# EAGLE design EpromEmu (EAGLE 6.6.0)
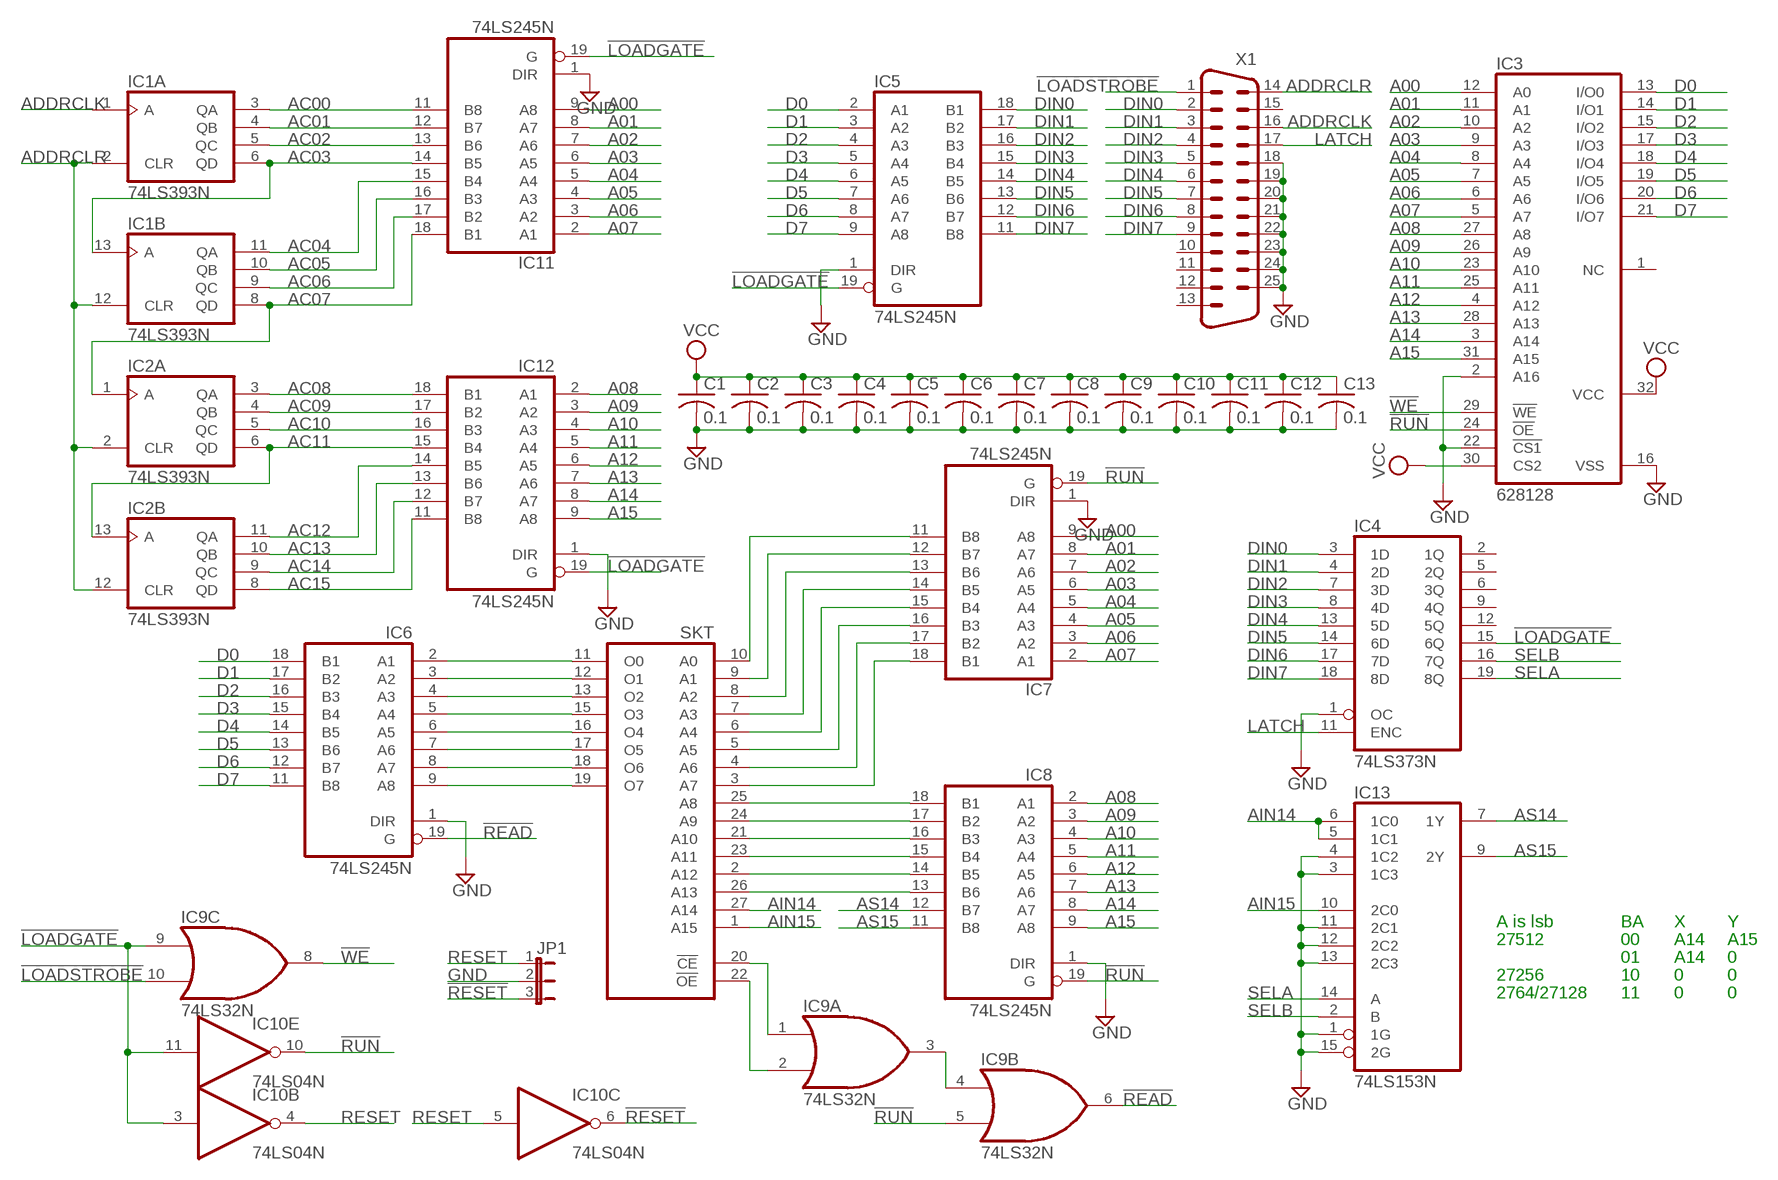
[diagram p0: schematic, sheet 1]

## Parts
C1  0.1  C-US050-025X075  [C050-025X075]
C2  0.1  C-US050-025X075  [C050-025X075]
C3  0.1  C-US050-025X075  [C050-025X075]
C4  0.1  C-US050-025X075  [C050-025X075]
C5  0.1  C-US050-025X075  [C050-025X075]
C6  0.1  C-US050-025X075  [C050-025X075]
C7  0.1  C-US050-025X075  [C050-025X075]
C8  0.1  C-US050-025X075  [C050-025X075]
C9  0.1  C-US050-025X075  [C050-025X075]
C10  0.1  C-US050-025X075  [C050-025X075]
C11  0.1  C-US050-025X075  [C050-025X075]
C12  0.1  C-US050-025X075  [C050-025X075]
C13  0.1  C-US050-025X075  [C050-025X075]
IC1  74LS393N  [DIL14]
IC2  74LS393N  [DIL14]
IC3  628128  628128P  [DIL32]
IC4  74LS373N  [DIL20]
IC5  74LS245N  [DIL20]
IC6  74LS245N  [DIL20]
IC7  74LS245N  [DIL20]
IC8  74LS245N  [DIL20]
IC9  74LS32N  [DIL14]
IC10  74LS04N  [DIL14]
IC11  74LS245N  [DIL20]
IC12  74LS245N  [DIL20]
IC13  74LS153N  [DIL16]
JP1  JP2E  [JP2]
SKT  27512  [DIL28]
X1  M25HP  [M25HP]

## Nets
!LOADGATE: IC4.15(6Q) IC5.19(G) IC9.9(C:I0) IC10.3(B:I) IC10.11(E:I) IC11.19(G) IC12.19(G)
!LOADSTROBE: IC9.10(C:I1) X1.1
!READ: IC6.19(G) IC9.6(B:O)
!RESET: IC10.6(C:O) JP1.3
!RUN: IC3.24(!OE) IC7.19(G) IC8.19(G) IC9.5(B:I1) IC10.10(E:O)
!WE: IC3.29(!WE) IC9.8(C:O)
A00: IC3.12(A0) IC7.9(A8) IC11.9(A8)
A01: IC3.11(A1) IC7.8(A7) IC11.8(A7)
A02: IC3.10(A2) IC7.7(A6) IC11.7(A6)
A03: IC3.9(A3) IC7.6(A5) IC11.6(A5)
A04: IC3.8(A4) IC7.5(A4) IC11.5(A4)
A05: IC3.7(A5) IC7.4(A3) IC11.4(A3)
A06: IC3.6(A6) IC7.3(A2) IC11.3(A2)
A07: IC3.5(A7) IC7.2(A1) IC11.2(A1)
A08: IC3.27(A8) IC8.2(A1) IC12.2(A1)
A09: IC3.26(A9) IC8.3(A2) IC12.3(A2)
A10: IC3.23(A10) IC8.4(A3) IC12.4(A3)
A11: IC3.25(A11) IC8.5(A4) IC12.5(A4)
A12: IC3.4(A12) IC8.6(A5) IC12.6(A5)
A13: IC3.28(A13) IC8.7(A6) IC12.7(A6)
A14: IC3.3(A14) IC8.8(A7) IC12.8(A7)
A15: IC3.31(A15) IC8.9(A8) IC12.9(A8)
AC00: IC1.3(A:QA) IC11.11(B8)
AC01: IC1.4(A:QB) IC11.12(B7)
AC02: IC1.5(A:QC) IC11.13(B6)
AC03: IC1.6(A:QD) IC1.13(B:A) IC11.14(B5)
AC04: IC1.11(B:QA) IC11.15(B4)
AC05: IC1.10(B:QB) IC11.16(B3)
AC06: IC1.9(B:QC) IC11.17(B2)
AC07: IC1.8(B:QD) IC2.1(A:A) IC11.18(B1)
AC08: IC2.3(A:QA) IC12.18(B1)
AC09: IC2.4(A:QB) IC12.17(B2)
AC10: IC2.5(A:QC) IC12.16(B3)
AC11: IC2.6(A:QD) IC2.13(B:A) IC12.15(B4)
AC12: IC2.11(B:QA) IC12.14(B5)
AC13: IC2.10(B:QB) IC12.13(B6)
AC14: IC2.9(B:QC) IC12.12(B7)
AC15: IC2.8(B:QD) IC12.11(B8)
ADDRCLK: IC1.1(A:A) X1.16
ADDRCLR: IC1.2(A:CLR) IC1.12(B:CLR) IC2.2(A:CLR) IC2.12(B:CLR) X1.14
AIN14: IC13.5(1C1) IC13.6(1C0) SKT.27(A14)
AIN15: IC13.10(2C0) SKT.1(A15)
AS14: IC8.12(B7) IC13.7(1Y)
AS15: IC8.11(B8) IC13.9(2Y)
D0: IC3.13(I/O0) IC5.2(A1) IC6.18(B1)
D1: IC3.14(I/O1) IC5.3(A2) IC6.17(B2)
D2: IC3.15(I/O2) IC5.4(A3) IC6.16(B3)
D3: IC3.17(I/O3) IC5.5(A4) IC6.15(B4)
D4: IC3.18(I/O4) IC5.6(A5) IC6.14(B5)
D5: IC3.19(I/O5) IC5.7(A6) IC6.13(B6)
D6: IC3.20(I/O6) IC5.8(A7) IC6.12(B7)
D7: IC3.21(I/O7) IC5.9(A8) IC6.11(B8)
DIN0: IC4.3(1D) IC5.18(B1) X1.2
DIN1: IC4.4(2D) IC5.17(B2) X1.3
DIN2: IC4.7(3D) IC5.16(B3) X1.4
DIN3: IC4.8(4D) IC5.15(B4) X1.5
DIN4: IC4.13(5D) IC5.14(B5) X1.6
DIN5: IC4.14(6D) IC5.13(B6) X1.7
DIN6: IC4.17(7D) IC5.12(B7) X1.8
DIN7: IC4.18(8D) IC5.11(B8) X1.9
GND: C1.2 C2.2 C3.2 C4.2 C5.2 C6.2 C7.2 C8.2 C9.2 C10.2 C11.2 C12.2 C13.2 IC3.2(A16) IC3.16(VSS) IC3.22(!CS1) IC4.1(OC) IC5.1(DIR) IC6.1(DIR) IC7.1(DIR) IC8.1(DIR) IC11.1(DIR) IC12.1(DIR) IC13.1(1G) IC13.3(1C3) IC13.4(1C2) IC13.11(2C1) IC13.12(2C2) IC13.13(2C3) IC13.15(2G) JP1.2 X1.18 X1.19 X1.20 X1.21 X1.22 X1.23 X1.24 X1.25
LATCH: IC4.11(ENC) X1.17
N$1: IC6.2(A1) SKT.11(O0)
N$2: IC6.3(A2) SKT.12(O1)
N$3: IC6.4(A3) SKT.13(O2)
N$4: IC6.5(A4) SKT.15(O3)
N$5: IC6.6(A5) SKT.16(O4)
N$6: IC6.7(A6) SKT.17(O5)
N$7: IC6.8(A7) SKT.18(O6)
N$8: IC6.9(A8) SKT.19(O7)
N$9: IC9.2(A:I1) SKT.22(!OE)
N$10: IC9.1(A:I0) SKT.20(!CE)
N$11: IC8.13(B6) SKT.26(A13)
N$12: IC8.14(B5) SKT.2(A12)
N$13: IC8.15(B4) SKT.23(A11)
N$14: IC8.16(B3) SKT.21(A10)
N$15: IC8.17(B2) SKT.24(A9)
N$16: IC8.18(B1) SKT.25(A8)
N$17: IC7.18(B1) SKT.3(A7)
N$18: IC7.17(B2) SKT.4(A6)
N$19: IC7.16(B3) SKT.5(A5)
N$20: IC7.15(B4) SKT.6(A4)
N$21: IC7.14(B5) SKT.7(A3)
N$22: IC7.13(B6) SKT.8(A2)
N$23: IC7.12(B7) SKT.9(A1)
N$24: IC7.11(B8) SKT.10(A0)
N$25: IC9.3(A:O) IC9.4(B:I0)
RESET: IC10.4(B:O) IC10.5(C:I) JP1.1
SELA: IC4.19(8Q) IC13.14(A)
SELB: IC4.16(7Q) IC13.2(B)
VCC [power]: C1.1 C2.1 C3.1 C4.1 C5.1 C6.1 C7.1 C8.1 C9.1 C10.1 C11.1 C12.1 C13.1 IC3.30(CS2) IC3.32(VCC)
Unconnected: IC3.1(NC) IC4.2(1Q) IC4.5(2Q) IC4.6(3Q) IC4.9(4Q) IC4.12(5Q) IC9.11(D:O) IC9.12(D:I0) IC9.13(D:I1) IC10.1(A:I) IC10.2(A:O) IC10.8(D:O) IC10.9(D:I) IC10.12(F:O) IC10.13(F:I) X1.10 X1.11 X1.12 X1.13 X1.15 X1.G1 X1.G2

## Notes on the sheet
- A is lsb | BA | X | Y
- 27512 | 00 | A14 | A15
- 01 | A14 | 0
- 27256 | 10 | 0 | 0
- 2764/27128 | 11 | 0 | 0

## Power pins joined to a net without a drawn wire
GND: IC1.7(P:GND) IC2.7(P:GND) IC4.10(GND) IC5.10(GND) IC6.10(GND) IC7.10(GND) IC8.10(GND) IC9.7(P:GND) IC10.7(P:GND) IC11.10(GND) IC12.10(GND) IC13.8(GND) SKT.14(GND)
VCC: IC1.14(P:VCC) IC2.14(P:VCC) IC4.20(VCC) IC5.20(VCC) IC6.20(VCC) IC7.20(VCC) IC8.20(VCC) IC9.14(P:VCC) IC10.14(P:VCC) IC11.20(VCC) IC12.20(VCC) IC13.16(VCC) SKT.28(VCC)

## Library data of the parts
C1-C13 = rcl:C-US: CAPACITOR, American symbol
IC1 IC2 = 74xx-us:74*393: Dual 4-bit decade and binary COUNTER
IC3 = memory-hitachi:628128P: MEMORY; OC_FARNELL: unknown; OC_NEWARK: unknown
IC4 = 74xx-us:74*373: Octal D type transparent LATCH, edge triggered
IC5-IC8 IC11 IC12 = 74xx-us:74*245: Octal BUS TRANSCEIVER, 3-state
IC9 = 74xx-us:74*32: Quad 2-input OR gate
IC10 = 74xx-us:74*04: Hex INVERTER
IC13 = 74xx-us:74*153: Dual 4-line to 1-line data SELECTOR/MULTIPLEXER
JP1 = jumper:JP2E: JUMPER
SKT = memory:27512: MEMORY
X1 = con-subd:M25HP: SUB-D; OC_FARNELL: unknown; OC_NEWARK: unknown

## Net classes
1 power: width 0.508 mm, clearance 0.127 mm

## Board
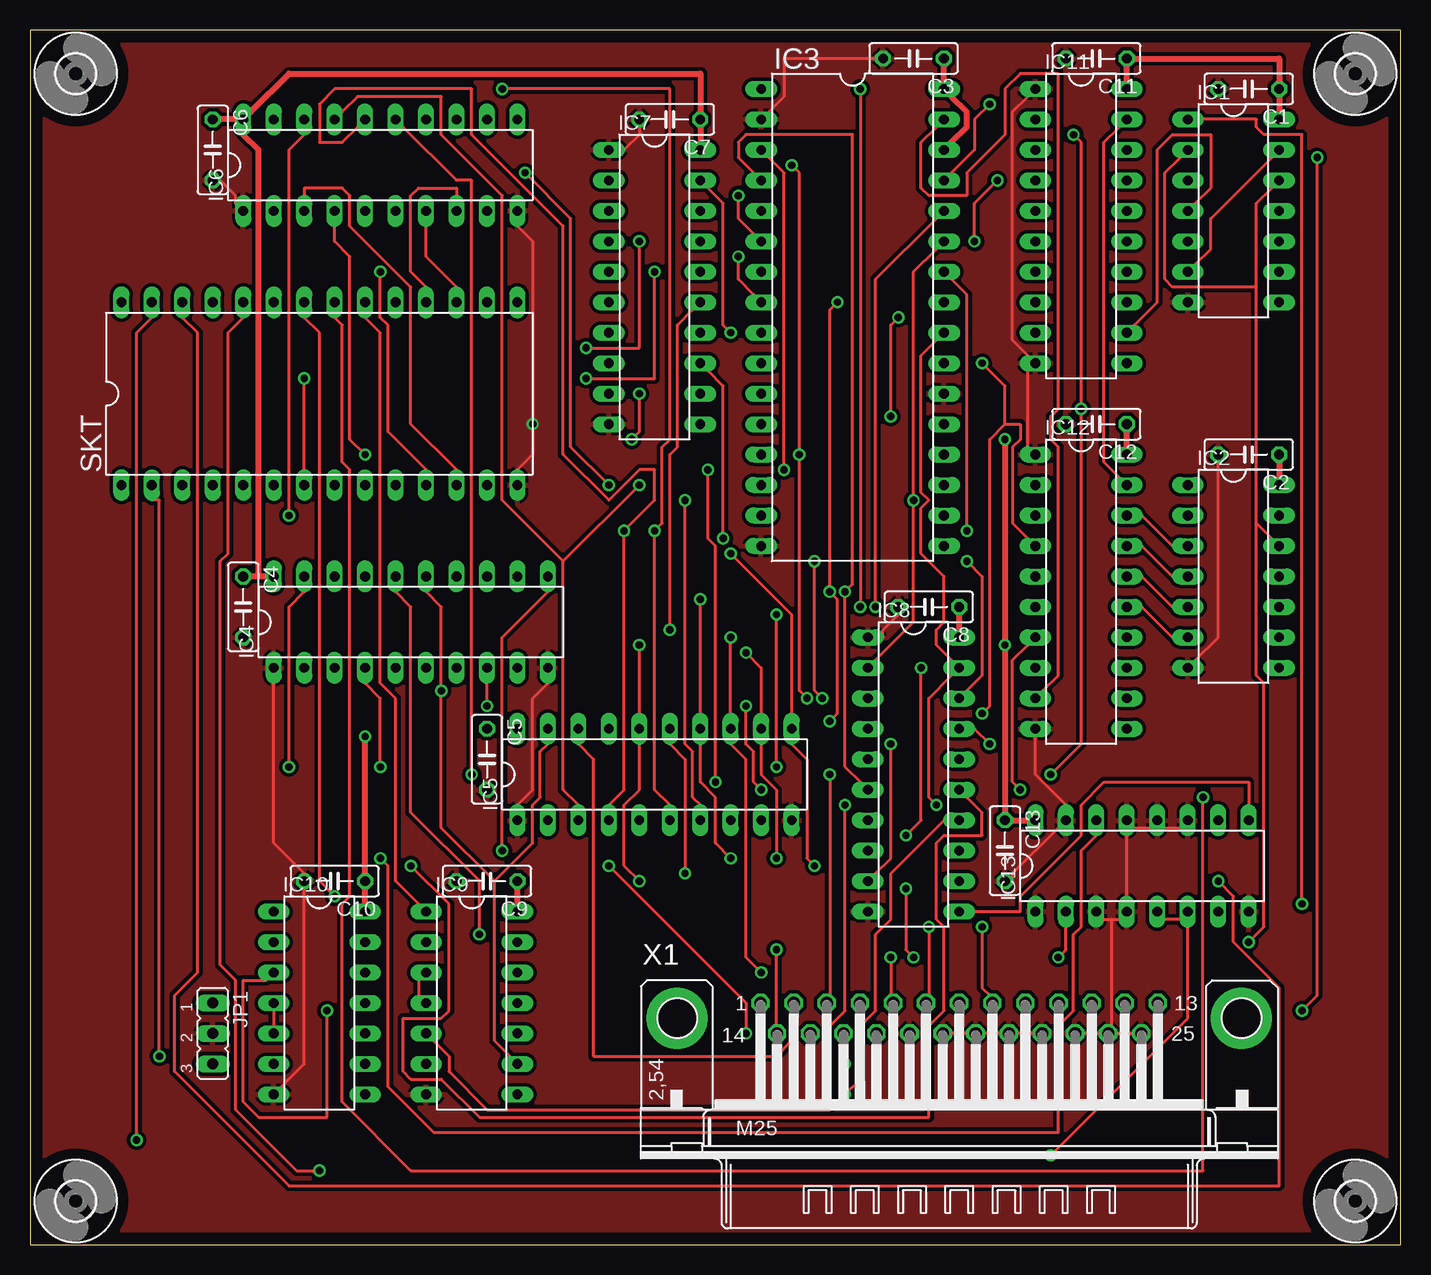
[diagram p1: board, top side]
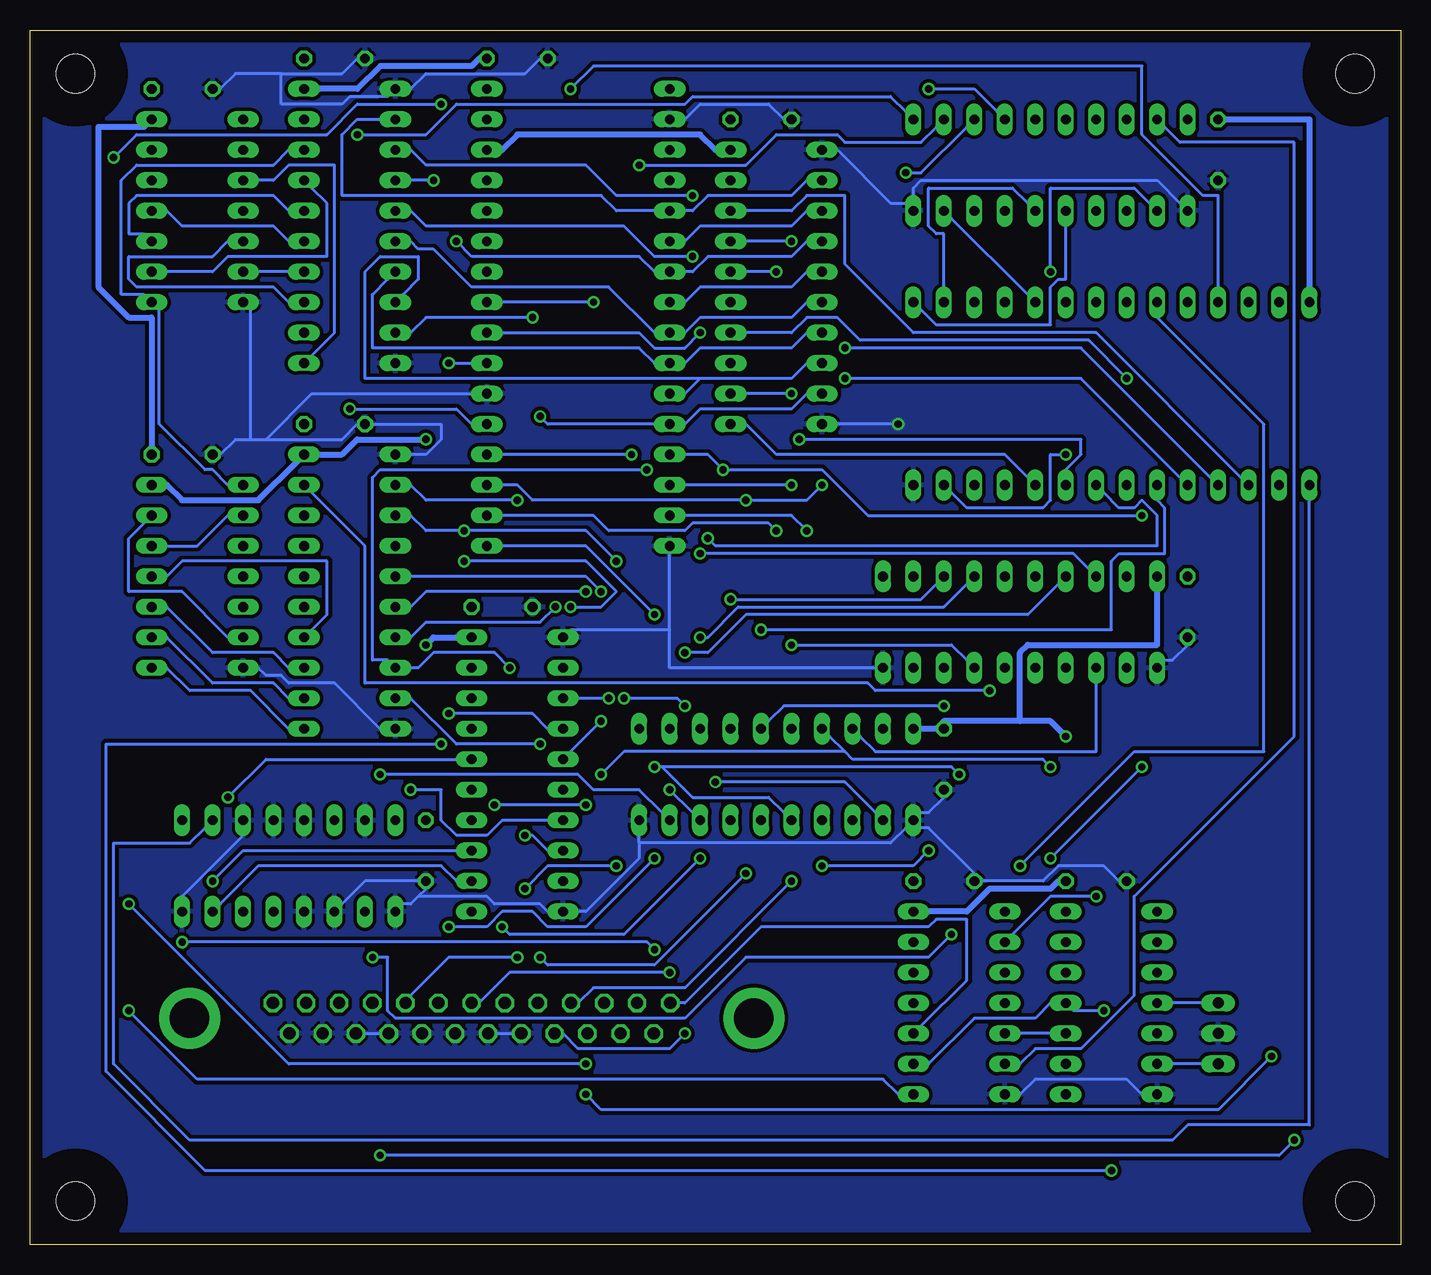
[diagram p2: board, bottom side, seen from below]

Size 114.28 x 101.27 mm. Coordinates in mm from the lower left corner, seen from the top.
Outline: 0,0 114.28,0 114.28,101.27 0,101.27 0,0
Copper layers (1*16): Top 0.035mm / dielectric 1.5mm / Bottom 0.035mm
Design rules "default": minimum track width 10mil, minimum drill 24mil, track to track 8mil, track to pad 8mil, pad to pad 8mil, via to via 8mil, smd to smd 8mil, copper to edge 40mil, drill to drill 8mil, minimum pad ring 10mil, minimum via ring 8mil, stop-mask expansion 4mil, vias tented up to drill 0mil, thermal gap 10mil

### Footprints (pad centres in the part's own frame; a part is rotated, then mirrored left to right if it is on the bottom)
C050-025X075 = drill 0.813 octagon: 1 -2.54,0; 2 2.54,0
DIL14 = drill 0.813 long: 1 -7.62,-3.81; 2 -5.08,-3.81; 3 -2.54,-3.81; 4 0,-3.81; 5 2.54,-3.81; 6 5.08,-3.81; 7 7.62,-3.81; 8 7.62,3.81; 9 5.08,3.81; 10 2.54,3.81; 11 0,3.81; 12 -2.54,3.81; 13 -5.08,3.81; 14 -7.62,3.81
DIL32 = drill 0.813 long: 1 -19.05,-7.62; 2 -16.51,-7.62; 3 -13.97,-7.62; 4 -11.43,-7.62; 5 -8.89,-7.62; 6 -6.35,-7.62; 7 -3.81,-7.62; 8 -1.27,-7.62; 9 1.27,-7.62; 10 3.81,-7.62; 11 6.35,-7.62; 12 8.89,-7.62; 13 11.43,-7.62; 14 13.97,-7.62; 15 16.51,-7.62; 16 19.05,-7.62; 17 19.05,7.62; 18 16.51,7.62; 19 13.97,7.62; 20 11.43,7.62; 21 8.89,7.62; 22 6.35,7.62; 23 3.81,7.62; 24 1.27,7.62; 25 -1.27,7.62; 26 -3.81,7.62; 27 -6.35,7.62; 28 -8.89,7.62; 29 -11.43,7.62; 30 -13.97,7.62; 31 -16.51,7.62; 32 -19.05,7.62
DIL20 = drill 0.813 long: 1 -11.43,-3.81; 2 -8.89,-3.81; 3 -6.35,-3.81; 4 -3.81,-3.81; 5 -1.27,-3.81; 6 1.27,-3.81; 7 3.81,-3.81; 8 6.35,-3.81; 9 8.89,-3.81; 10 11.43,-3.81; 11 11.43,3.81; 12 8.89,3.81; 13 6.35,3.81; 14 3.81,3.81; 15 1.27,3.81; 16 -1.27,3.81; 17 -3.81,3.81; 18 -6.35,3.81; 19 -8.89,3.81; 20 -11.43,3.81
DIL16 = drill 0.813 long: 1 -8.89,-3.81; 2 -6.35,-3.81; 3 -3.81,-3.81; 4 -1.27,-3.81; 5 1.27,-3.81; 6 3.81,-3.81; 7 6.35,-3.81; 8 8.89,-3.81; 9 8.89,3.81; 10 6.35,3.81; 11 3.81,3.81; 12 1.27,3.81; 13 -1.27,3.81; 14 -3.81,3.81; 15 -6.35,3.81; 16 -8.89,3.81
JP2 = drill 0.914 long: 1 -2.54,0; 2 0,0; 3 2.54,0
DIL28 = drill 0.813 long: 1 -16.51,-7.62; 2 -13.97,-7.62; 3 -11.43,-7.62; 4 -8.89,-7.62; 5 -6.35,-7.62; 6 -3.81,-7.62; 7 -1.27,-7.62; 8 1.27,-7.62; 9 3.81,-7.62; 10 6.35,-7.62; 11 8.89,-7.62; 12 11.43,-7.62; 13 13.97,-7.62; 14 16.51,-7.62; 15 16.51,7.62; 16 13.97,7.62; 17 11.43,7.62; 18 8.89,7.62; 19 6.35,7.62; 20 3.81,7.62; 21 1.27,7.62; 22 -1.27,7.62; 23 -3.81,7.62; 24 -6.35,7.62; 25 -8.89,7.62; 26 -11.43,7.62; 27 -13.97,7.62; 28 -16.51,7.62
3,2 = hole 3.2: 0,0
M25HP = drill 1.016 octagon: 1 -16.561,1.27; 2 -13.792,1.27; 3 -11.049,1.27; 4 -8.28,1.27; 5 -5.512,1.27; 6 -2.769,1.27; 7 0,1.27; 8 2.769,1.27; 9 5.512,1.27; 10 8.28,1.27; 11 11.049,1.27; 12 13.792,1.27; 13 16.561,1.27; 14 -15.189,-1.27; 15 -12.421,-1.27; 16 -9.652,-1.27; 17 -6.909,-1.27; 18 -4.14,-1.27; 19 -1.372,-1.27; 20 1.372,-1.27; 21 4.14,-1.27; 22 6.909,-1.27; 23 9.652,-1.27; 24 12.421,-1.27; 25 15.189,-1.27 | drill 3.302 pad 5.08: G1 -23.52,0; G2 23.52,0

### Placement (x,y rotation side)
C1  101.59,96.35 180 top
C2  101.59,65.88 180 top
C3  73.66,98.89 180 top
C4  17.78,53.18 270 top
C5  38.09,40.48 270 top
C6  15.23,91.27 270 top
C7  53.34,93.81 180 top
C8  74.93,53.18 180 top
C9  38.09,30.32 180 top
C10  25.39,30.32 180 top
C11  88.9,98.89 180 top
C12  88.9,68.41 180 top
C13  81.28,32.86 270 top
IC1  100.33,86.19 270 top
IC2  100.33,55.72 270 top
IC3  68.58,77.3 270 top
IC4  31.75,51.91 0 top
IC5  52.06,39.2 0 top
IC6  29.21,90 0 top
IC7  52.06,79.84 270 top
IC8  73.66,39.2 270 top
IC9  36.82,20.16 270 top
IC10  24.12,20.16 270 top
IC11  87.62,84.92 270 top
IC12  87.62,54.45 270 top
IC13  92.7,31.59 0 top
JP1  15.23,17.62 270 top
SKT  24.12,70.95 0 top
U$1  [3,2]  3.81,97.62 0 top
U$2  [3,2]  3.81,3.65 0 top
U$3  [3,2]  110.48,3.65 0 top
U$4  [3,2]  110.48,97.62 0 top
X1  77.47,18.89 0 top

### Tracks (layer width: path | path; a pad name or v marks a point on that pad's centre or on a via)
!LOADGATE  (via drill 0.61)
  Top 0.254: IC12.19 90.8,63.97 89.53,65.24 89.53,91.91 90.8,93.18 IC11.19 | 38.73,30.32 34.28,34.76 v34.28,46.19 34.28,53.18 33.02,54.45 IC4.15 | 38.73,30.32 38.73,16.98 40,15.71 IC9.9 | 38.73,30.32 41.9,33.49 41.9,36.66 42.54,37.3 42.54,41.11 43.17,41.74 IC5.19 | v24.76,19.52 24.76,10.63 19.05,10.63 17.78,11.9 17.78,22.06 19.68,22.06 IC10.3
  Bottom 0.254: IC9.9 39.36,15.08 35.55,18.89 30.48,18.89 29.21,20.16 IC10.11 27.3,19.52 v24.76,19.52 | v34.28,46.19 43.81,46.19 44.45,46.83 86.36,46.83 86.36,58.26 90.8,62.7 IC12.19
!LOADSTROBE
  Bottom 0.254: IC9.10 40,18.25 36.19,22.06 36.19,27.14 38.73,27.14 39.36,26.51 53.34,26.51 59.68,20.16 60.32,20.16 X1.1
!READ
  Bottom 0.254: IC9.6 31.75,15.08 30.48,16.35 26.67,16.35 22.22,20.79 22.22,29.05 8.88,42.38 8.88,91.91 18.41,91.91 19.68,93.18 IC6.19
!RESET
  Bottom 0.254: IC10.6 19.05,15.08 16.51,15.08 JP1.3
!RUN  (via drill 0.61)
  Top 0.254: IC3.24 75.56,75.4 74.29,74.13 74.29,62.7 74.93,62.06 74.29,61.43 74.29,57.62 76.2,55.72 76.2,51.91 75.56,51.27 75.56,50 76.83,48.73 IC8.19 76.83,47.46 74.93,45.55 74.93,37.3 v75.56,36.66 | v58.41,76.03 57.78,76.67 57.78,86.83 56.51,88.1 IC7.19 | v67.94,36.66 67.94,19.52 66.67,18.25 66.67,11.27 38.09,11.27 34.92,14.44 34.92,15.71 33.65,16.98 IC9.5
  Bottom 0.254: IC10.10 29.21,17.62 31.75,17.62 IC9.5 | v58.41,76.03 59.68,74.77 62.22,74.77 63.49,76.03 74.93,76.03 IC3.24 | v67.94,36.66 v75.56,36.66
!WE  (via drill 0.61)
  Top 0.254: v106.04,19.52 107.31,20.79 v107.31,90.64 | v80.01,95.08 78.73,93.81 78.73,91.27 76.83,89.37 IC3.29
  Bottom 0.254: v106.04,19.52 100.33,13.81 43.17,13.81 41.9,12.54 IC9.8 | v107.31,90.64 105.41,92.54 89.53,92.54 86.99,95.08 v80.01,95.08
A00  (via drill 0.61)
  Top 0.254: v72.39,77.3 71.75,76.67 v71.75,69.05
  Bottom 0.254: IC7.9 49.52,70.95 50.79,69.68 58.41,69.68 59.68,68.41 IC3.12 62.22,68.41 71.12,68.41 v71.75,69.05 | v72.39,77.3 81.28,77.3 82.55,76.03 IC11.9
A01
  Bottom 0.254: 58.41,72.22 50.79,72.22 49.52,73.49 IC7.8 | 58.41,72.22 59.68,70.95 IC3.11 | 58.41,72.22 86.36,72.22 86.36,81.11 85.09,82.38 81.91,82.38 81.91,80.48 83.18,79.21 IC11.8
A02
  Bottom 0.254: IC7.7 49.52,76.03 50.79,74.77 58.41,74.77 59.68,73.49 IC3.10 62.22,73.49 63.49,74.77 85.72,74.77 85.72,79.21 84.45,80.48 IC11.7
A03
  Bottom 0.254: IC7.6 49.52,78.57 50.79,77.3 58.41,77.3 59.68,76.03 IC3.9 62.22,76.03 66.04,79.84 77.47,79.84 80.64,83.02 81.91,83.02 82.55,83.65 IC11.6
A04  (via drill 0.61)
  Top 0.254: v59.05,82.38 59.05,80.48 60.32,79.21 IC3.8
  Bottom 0.254: IC7.5 49.52,81.11 50.79,79.84 58.41,79.84 59.68,78.57 IC3.8 | v59.05,82.38 62.22,82.38 64.77,84.92 81.28,84.92 82.55,86.19 IC11.5
A05  (via drill 0.61)
  Top 0.254: v80.64,88.73 78.73,86.83 v78.73,83.65
  Bottom 0.254: IC7.4 49.52,83.65 50.79,82.38 57.78,82.38 59.05,81.11 59.68,81.11 IC3.7 62.22,81.11 63.49,82.38 77.47,82.38 v78.73,83.65 | v80.64,88.73 82.55,88.73 IC11.4
A06  (via drill 0.61)
  Top 0.254: v59.05,87.46 59.05,85.56 60.32,84.29 IC3.6
  Bottom 0.254: IC7.3 49.52,86.19 50.79,84.92 58.41,84.92 59.68,83.65 IC3.6 | v59.05,87.46 65.4,87.46 67.94,90 81.28,90 82.55,91.27 IC11.3
A07
  Bottom 0.254: IC7.2 49.52,88.73 50.79,87.46 57.78,87.46 59.05,86.19 59.68,86.19 IC3.5 62.22,86.19 65.4,86.19 66.67,87.46 88.26,87.46 88.26,92.54 86.99,93.81 85.09,93.81 IC11.2
A08  (via drill 0.61)
  Top 0.254: IC8.2 70.48,48.73 73.66,51.91 v73.66,62.06 73.66,81.11 75.56,83.02 IC3.27
  Bottom 0.254: v73.66,62.06 81.28,62.06 82.55,63.34 IC12.2
A09  (via drill 0.61)
  Top 0.254: v66.04,45.55 65.4,46.19 v65.4,56.98 | v78.1,59.52 78.1,79.21 76.83,80.48 IC3.26
  Bottom 0.254: v66.04,45.55 68.58,45.55 IC8.3 | v65.4,56.98 67.94,59.52 v78.1,59.52 81.28,59.52 82.55,60.8 IC12.3
A10  (via drill 0.61)
  Top 0.254: v79.37,44.29 80.01,44.92 80.01,67.14 81.28,68.41 | 81.28,68.41 82.55,68.41 82.55,67.14 81.91,66.51 81.91,60.16 83.18,58.89 IC12.4 | v79.37,73.49 81.28,71.59 81.28,68.41
  Bottom 0.254: v79.37,44.29 72.39,44.29 71.12,43.02 IC8.4 | v79.37,73.49 77.47,73.49 IC3.23
A11  (via drill 0.61)
  Top 0.254: v66.67,43.65 67.31,44.29 67.31,53.81 v66.67,54.45 66.67,77.94 v67.31,78.57
  Bottom 0.254: v66.67,43.65 69.21,41.11 IC8.5 | v66.67,54.45 67.94,55.72 82.55,55.72 IC12.5 | v67.31,78.57 74.93,78.57 IC3.25
A12  (via drill 0.61)
  Top 0.254: IC8.6 69.21,38.57 67.94,39.84 v67.94,54.45 68.58,55.08 68.58,92.54 59.68,92.54 59.05,91.91 59.05,90.64 60.32,89.37 IC3.4
  Bottom 0.254: v67.94,54.45 81.28,54.45 82.55,53.18 IC12.6
A13  (via drill 0.61)
  Top 0.254: v82.55,37.94 81.91,38.57 81.91,48.73 83.18,50 IC12.7 | v70.48,53.18 70.48,80.48 75.56,85.56 IC3.28
  Bottom 0.254: v82.55,37.94 80.01,37.94 80.01,35.4 78.73,34.12 76.2,34.12 74.93,35.4 71.12,35.4 IC8.7 | v70.48,53.18 71.75,51.91 81.28,51.91 82.55,50.63 IC12.7
A14  (via drill 0.61)
  Top 0.254: v73.02,34.12 74.29,35.4 v74.29,48.09 | v62.86,64.6 62.86,89.37 61.59,90.64 IC3.3
  Bottom 0.254: v73.02,34.12 72.39,34.12 71.12,32.86 IC8.8 | v74.29,48.09 75.56,49.37 80.64,49.37 81.91,48.09 82.55,48.09 IC12.8 84.45,48.73 85.72,48.73 85.72,63.97 85.09,64.6 v62.86,64.6
A15  (via drill 0.61)
  Top 0.254: v71.75,41.74 71.75,32.22 70.48,30.95 IC8.9 | IC3.31 75.56,93.18 74.29,91.91 74.29,88.1 74.93,87.46 78.1,87.46 78.1,89.37 81.28,92.54 81.28,96.35 82.55,97.62 85.72,97.62 85.72,69.68 85.09,69.05 85.09,67.14 85.72,66.51 85.72,47.46 84.45,46.19 IC12.9
  Bottom 0.254: v71.75,41.74 78.73,41.74 82.55,45.55 IC12.9
AC00
  Bottom 0.254: IC11.11 90.8,74.13 88.9,76.03 88.9,90 92.7,90 93.98,88.73 95.25,88.73 IC1.3
AC01
  Top 0.254: IC11.12 92.07,76.67 93.98,78.57 93.98,91.27 95.25,92.54 98.42,92.54 98.42,88.1 97.15,86.83 IC1.4
AC02
  Bottom 0.254: IC11.13 92.7,78.57 93.98,79.84 105.41,79.84 106.04,80.48 106.04,82.38 99.06,82.38 97.79,83.65 IC1.5
AC03
  Top 0.254: IC1.13 103.5,90.64 98.42,85.56 98.42,83.02 97.15,81.75 IC1.6
  Bottom 0.254: IC11.14 92.7,81.11 95.25,81.11 IC1.6
AC04
  Bottom 0.254: IC11.15 92.7,83.65 93.98,84.92 101.59,84.92 102.87,86.19 IC1.11
AC05
  Bottom 0.254: IC11.16 92.7,86.19 93.98,87.46 105.41,87.46 106.04,86.83 106.04,84.29 104.77,84.29 IC1.10
AC06
  Bottom 0.254: IC11.17 90.8,88.1 89.53,86.83 89.53,82.38 97.79,82.38 99.06,81.11 102.87,81.11 IC1.9
AC07
  Bottom 0.254: IC2.1 97.79,63.34 99.06,64.6 99.69,64.6 103.5,68.41 103.5,77.94 IC1.8 104.77,79.21 106.68,79.21 106.68,88.73 105.41,90 93.98,90 92.7,91.27 IC11.18
AC08
  Top 0.254: IC12.18 92.7,60.8 95.25,58.26 IC2.3
AC09
  Top 0.254: IC12.17 92.7,58.26 95.25,55.72 IC2.4
AC10
  Top 0.254: IC12.16 92.7,55.72 95.25,53.18 IC2.5
AC11
  Top 0.254: IC12.15 92.7,53.18 95.25,50.63 IC2.6
  Bottom 0.254: IC2.13 104.77,60.16 106.04,58.89 106.04,54.45 101.59,54.45 97.79,50.63 IC2.6
AC12
  Bottom 0.254: IC12.14 90.8,51.27 89.53,52.54 89.53,56.98 101.59,56.98 102.87,55.72 IC2.11
AC13
  Bottom 0.254: IC12.13 92.7,48.09 93.98,49.37 99.06,49.37 102.87,53.18 IC2.10
AC14
  Bottom 0.254: IC12.12 92.7,45.55 93.98,46.83 99.06,46.83 102.87,50.63 IC2.9
AC15
  Bottom 0.254: IC12.11 92.7,43.02 95.88,46.19 100.96,46.19 102.87,48.09 IC2.8
ADDRCLK  (via drill 0.61)
  Top 0.254: v106.04,28.41 106.04,92.54 102.87,92.54 102.23,93.18 102.23,93.81 97.79,93.81 IC1.1 | v67.94,15.08 67.94,16.98 X1.16
  Bottom 0.254: v106.04,28.41 92.7,15.08 v67.94,15.08
ADDRCLR  (via drill 0.61)
  Top 0.254: 102.23,60.16 102.23,79.84 | 102.23,79.84 102.23,86.83 103.5,88.1 IC1.12 | 102.23,60.16 103.5,58.89 IC2.12 | 102.23,79.84 95.25,79.84 94.61,80.48 94.61,89.37 95.88,90.64 IC1.2 | v62.22,24.6 62.22,18.25 X1.14 | v101.59,25.23 102.87,26.51 102.87,46.83 102.23,47.46 102.23,60.16
  Bottom 0.254: IC2.2 97.79,60.8 100.33,58.26 102.87,58.26 IC2.12 | v62.22,24.6 62.86,25.23 v101.59,25.23
AIN14  (via drill 0.61)
  Top 0.254: IC13.5 94.61,27.14 95.88,27.14 IC13.6 96.52,26.51 96.52,18.89 v85.09,7.46 | v8.88,8.73 8.88,76.03 10.15,77.3 SKT.27
  Bottom 0.254: v8.88,8.73 10.15,7.46 v85.09,7.46
AIN15
  Bottom 0.254: SKT.1 7.62,62.06 7.62,10 17.78,10 19.05,8.73 100.96,8.73 107.31,15.08 107.31,33.49 100.96,33.49 99.69,34.76 IC13.10
AS14
  Bottom 0.254: IC8.12 78.73,30.32 80.01,31.59 95.25,31.59 98.42,28.41 IC13.7
AS15
  Top 0.254: IC8.11 78.73,27.78 82.55,27.78 82.55,29.05 87.62,34.12 87.62,36.66 89.53,38.57 101.59,38.57 101.59,36.66 IC13.9
D0  (via drill 0.61)
  Top 0.254: v57.14,38.57 57.14,58.26 56.51,58.89 v56.51,64.6 | v21.59,60.8 21.59,91.27 22.86,92.54 IC6.18
  Bottom 0.254: v57.14,38.57 46.35,38.57 43.81,36.03 IC5.2 | IC3.13 59.68,65.88 57.78,65.88 v56.51,64.6 48.25,64.6 44.45,60.8 v21.59,60.8
D1  (via drill 0.61)
  Top 0.254: 44.45,56.98 44.45,37.94 45.71,36.66 IC5.3 | 44.45,56.98 v50.79,63.34 | 44.45,56.98 39.36,62.06 39.36,87.46 34.28,92.54 34.28,95.72 27.3,95.72 26.03,94.45 IC6.17
  Bottom 0.254: v50.79,63.34 59.68,63.34 IC3.14
D2  (via drill 0.61)
  Top 0.254: IC5.4 48.25,36.66 49.52,37.94 v49.52,59.52 52.06,62.06 52.06,64.6 50.79,64.6 48.25,62.06 44.45,65.88 44.45,84.92 36.82,92.54 36.82,96.35 25.39,96.35 24.12,95.08 24.12,91.91 26.03,91.91 27.3,93.18 IC6.16
  Bottom 0.254: v49.52,59.52 50.79,60.8 59.68,60.8 IC3.15
D3  (via drill 0.61)
  Top 0.254: v62.22,39.84 v62.22,52.54 | v36.82,39.2 36.82,88.73 35.55,88.73 31.11,93.18 IC6.15
  Bottom 0.254: 61.59,39.84 59.05,37.3 52.7,37.3 51.43,36.03 IC5.5 | 61.59,39.84 v62.22,39.84 | v62.22,52.54 67.94,58.26 74.93,58.26 IC3.17 | v36.82,39.2 37.46,39.84 61.59,39.84
D4  (via drill 0.61)
  Top 0.254: IC5.6 53.34,36.66 52.06,37.94 v52.06,59.52 52.7,60.16 52.7,66.51 53.34,67.14 53.34,96.35 v39.36,96.35
  Bottom 0.254: v52.06,59.52 52.7,60.16 59.05,60.16 59.68,59.52 66.04,59.52 67.31,60.8 74.93,60.8 IC3.18 | v39.36,96.35 35.55,96.35 33.65,94.45 IC6.14
D5  (via drill 0.61)
  Top 0.254: v54.6,62.06 54.6,41.74 55.24,41.11 55.24,37.3 55.88,36.66 IC5.7 | v41.27,89.37 45.08,85.56 45.08,66.51 v48.25,63.34
  Bottom 0.254: IC3.19 74.93,63.34 73.66,63.34 72.39,62.06 v54.6,62.06 49.52,62.06 v48.25,63.34 | v41.27,89.37 40,89.37 36.19,93.18 IC6.13
D6  (via drill 0.61)
  Top 0.254: v60.95,37.94 60.32,38.57 60.32,41.11 59.68,41.74 v59.68,44.92 | v64.77,45.55 64.13,46.19 v64.13,65.88 64.13,89.37 v63.49,90
  Bottom 0.254: v60.95,37.94 59.05,36.03 IC5.8 | v59.68,44.92 60.32,45.55 v64.77,45.55 | v64.13,65.88 74.93,65.88 IC3.20 | v63.49,90 54.6,90 52.06,92.54 46.98,92.54 46.35,91.91 40,91.91 38.73,93.18 IC6.12
D7  (via drill 0.61)
  Top 0.254: v85.09,39.2 87.62,41.74 v87.62,69.68 87.62,91.91 v86.99,92.54
  Bottom 0.254: v85.09,39.2 68.58,39.2 67.31,37.94 63.49,37.94 61.59,36.03 IC5.9 | v87.62,69.68 78.73,69.68 77.47,68.41 IC3.21 | v86.99,92.54 81.28,92.54 78.73,95.08 59.68,95.08 59.05,95.72 42.54,95.72 41.27,94.45 IC6.11
DIN0
  Top 0.254: X1.2 63.49,19.52 63.49,16.98 62.22,15.71 46.98,15.71 46.98,40.48 45.71,41.74 IC5.18
  Bottom 0.254: IC4.3 25.39,46.83 25.39,41.11 43.81,41.11 45.08,42.38 IC5.18
DIN1  (via drill 0.61)
  Top 0.254: v29.21,39.84 29.21,45.55 27.94,46.83 IC4.4 | v66.67,39.2 66.67,20.79 X1.3
  Bottom 0.254: v29.21,39.84 29.84,40.48 45.71,40.48 46.35,41.11 | 46.35,41.11 47.62,42.38 IC5.17 | v66.67,39.2 64.77,41.11 46.35,41.11
DIN2  (via drill 0.61)
  Top 0.254: v50.79,50 50.79,44.29 IC5.16 50.79,41.74 50.79,37.94 49.52,36.66 49.52,31.59 v50.79,30.32
  Bottom 0.254: v50.79,50 37.46,50 36.19,48.73 IC4.7 | v50.79,30.32 59.68,21.43 67.31,21.43 68.58,20.16 X1.4
DIN3  (via drill 0.61)
  Top 0.254: v38.09,44.92 38.09,46.83 IC4.8 | v71.75,23.96 71.75,20.79 X1.5 | v54.6,30.95 54.6,40.48 53.34,41.74 IC5.15
  Bottom 0.254: v38.09,44.92 51.43,44.92 52.7,43.65 IC5.15 | v71.75,23.96 71.12,23.33 62.22,23.33 v54.6,30.95
DIN4  (via drill 0.61)
  Top 0.254: v55.88,53.81 55.88,44.29 IC5.14 55.88,41.74 55.88,38.57 57.14,37.3 57.14,33.49 v58.41,32.22 | v74.93,26.51 74.93,20.79 X1.6
  Bottom 0.254: v55.88,53.81 40,53.81 38.73,55.08 IC4.13 | v74.93,26.51 74.29,25.87 64.77,25.87 v58.41,32.22
DIN5  (via drill 0.61)
  Top 0.254: v58.41,50.63 58.41,44.29 IC5.13 58.41,41.74 59.68,40.48 59.68,23.96 v60.95,22.7
  Bottom 0.254: v58.41,50.63 57.78,50.63 55.24,53.18 38.09,53.18 36.19,55.08 IC4.14 | v60.95,22.7 74.29,22.7 76.83,20.16 X1.7
DIN6  (via drill 0.61)
  Top 0.254: v59.68,49.37 60.95,48.09 60.95,44.29 IC5.12 60.95,41.74 60.95,39.2 62.22,37.94 v62.22,32.22 | v79.37,26.51 79.37,21.43 80.01,20.79 X1.8
  Bottom 0.254: v59.68,49.37 57.78,49.37 54.6,52.54 31.11,52.54 28.57,55.08 IC4.17 | v79.37,26.51 76.2,26.51 74.93,27.78 72.39,27.78 71.12,26.51 67.94,26.51 v62.22,32.22
DIN7  (via drill 0.61)
  Top 0.254: v58.41,57.62 63.49,52.54 63.49,44.29 IC5.11 63.49,41.74 64.77,40.48 64.77,32.22 v65.4,31.59 | v73.66,23.96 73.02,24.6 v73.02,29.68
  Bottom 0.254: v58.41,57.62 27.3,57.62 26.03,56.35 IC4.18 | v73.66,23.96 79.37,23.96 82.55,20.79 X1.9 | v73.02,29.68 71.12,31.59 v65.4,31.59
GND  (via drill 0.61)
  Top 0.254: IC10.7 20.95,13.17 22.86,15.08 22.86,29.68 C10.2 22.86,30.95 20.32,33.49 20.32,46.83 IC4.1 | C8.2 72.39,52.54 71.12,51.27 71.12,50.63 IC8.1 | IC4.10 43.17,46.83 41.9,45.55 41.9,37.94 40.63,36.66 IC5.1 | IC12.1 83.18,66.51 83.18,72.86 IC11.10 83.18,74.13 81.91,75.4 81.91,94.45 83.18,95.72 IC11.1 | IC2.7 97.15,48.73 99.06,50.63 99.06,65.24 C2.2 | X1.19 76.83,17.62 78.1,17.62 X1.20 79.37,17.62 81.28,17.62 X1.21 81.91,17.62 83.81,17.62 X1.22 | X1.24 89.53,17.62 87.62,17.62 X1.23 | X1.25 92.07,17.62 90.17,17.62 X1.24 | 90.17,27.14 90.8,27.14 IC13.4 91.44,29.05 91.44,34.12 IC13.13 92.07,34.76 93.34,34.76 IC13.12 94.61,34.76 95.88,34.76 IC13.11 | 90.17,27.14 89.53,27.14 IC13.3 | C13.2 81.91,30.32 81.91,30.95 85.72,34.76 IC13.15 86.36,36.66 83.81,39.2 83.81,42.38 IC12.10 | 90.17,27.14 90.17,18.25 X1.24 | IC7.1 49.52,91.27 50.79,92.54 50.79,93.18 C7.2 | C6.2 15.87,88.73 17.14,87.46 17.14,86.83 IC6.1 | SKT.14 40.63,64.6 41.9,65.88 v41.9,68.41 41.9,83.65 40.63,84.92 IC6.10 | C3.2 70.48,98.89 62.86,98.89 62.86,95.72 61.59,94.45 IC3.2
  Bottom 0.254: C4.2 17.78,50 19.05,48.73 19.68,48.73 IC4.1 | IC9.7 31.75,12.54 30.48,13.81 22.86,13.81 21.59,12.54 IC10.7 | 60.95,51.27 60.95,57.62 IC3.16 | 60.95,51.27 69.21,51.27 IC8.1 | IC5.1 40,34.76 39.36,34.76 35.55,30.95 C9.2 34.92,30.32 29.84,30.32 28.57,31.59 24.76,31.59 23.49,30.32 C10.2 | C5.2 38.09,37.3 39.36,36.03 40,36.03 IC5.1 | 60.95,51.27 60.95,48.09 43.81,48.09 IC4.10 | 95.88,67.14 97.15,67.14 98.42,65.88 C2.2 | 95.88,67.14 94.61,67.14 | 94.61,67.14 88.26,67.14 86.99,68.41 C12.2 85.72,68.41 80.01,68.41 80.01,67.14 81.28,65.88 82.55,65.88 IC12.1 | 94.61,67.14 90.8,70.95 77.47,70.95 IC3.22 | 95.88,67.14 95.88,77.94 IC1.7 | X1.18 73.66,17.62 75.56,17.62 X1.19 | X1.23 86.99,17.62 85.09,17.62 X1.22 | IC13.8 101.59,29.05 96.52,34.12 IC13.11 | 63.49,33.49 63.49,32.22 67.94,27.78 68.58,27.78 IC8.10 71.12,27.78 71.75,28.41 75.56,28.41 76.2,29.05 81.91,29.05 | 63.49,33.49 63.49,34.12 IC5.10 | 81.91,29.05 82.55,28.41 83.18,28.41 IC13.1 | 81.91,29.05 81.28,29.68 C13.2 81.91,30.32 86.36,30.32 88.26,28.41 IC13.3 | IC2.7 95.25,48.09 94.61,47.46 93.34,47.46 92.7,46.83 88.9,46.83 85.09,43.02 IC12.10 | 93.34,97.62 97.15,97.62 98.42,96.35 C1.2 | 93.34,97.62 88.26,97.62 86.99,98.89 C11.2 | C3.2 71.75,98.89 73.02,97.62 81.28,97.62 82.55,96.35 IC11.1 84.45,95.72 87.62,95.72 88.26,95.08 93.34,95.08 93.34,97.62 | IC3.2 59.68,93.81 58.41,95.08 52.7,95.08 51.43,93.81 C7.2 | v41.9,68.41 46.98,68.41 IC7.10 | IC6.1 18.41,86.83 20.32,88.73 40,88.73 40.63,88.1 40.63,87.46 IC6.10 41.27,86.83 42.54,86.83 46.98,91.27 IC7.1 | 63.49,33.49 42.54,33.49 41.27,34.76 IC5.1
  pour Top (isolate 0.305): -0.01,101.43 114.3,101.43 114.3,-0.17 -0.01,-0.17
  pour Bottom (isolate 0.305): -0.01,101.43 114.3,101.43 114.3,-0.17 -0.01,-0.17
LATCH  (via drill 0.61)
  Top 0.254: v39.36,32.86 39.36,50.63 43.17,54.45 IC4.11 | v48.25,31.59 59.68,20.16 v59.68,17.62
  Bottom 0.254: v39.36,32.86 40.63,31.59 v48.25,31.59 | v59.68,17.62 60.95,16.35 68.58,16.35 69.84,17.62 X1.17
N$1  (via drill 0.61)
  Top 0.254: v29.21,81.11 29.21,77.3 29.84,76.67 29.84,67.78 33.02,64.6 SKT.11
  Bottom 0.254: v29.21,81.11 29.21,88.1 22.22,88.1 20.95,86.83 IC6.2
N$2
  Top 0.254: SKT.12 35.55,64.6 31.75,68.41 31.75,79.84 26.67,84.92 26.67,87.46 26.03,88.1 22.86,88.1 22.86,87.46 IC6.3
N$3  (via drill 0.61)
  Top 0.254: v27.94,65.88 26.67,67.14 26.67,82.38 25.39,83.65 25.39,84.92 IC6.4
  Bottom 0.254: v27.94,65.88 29.21,65.88 29.21,62.06 29.84,61.43 36.19,61.43 37.46,62.7 SKT.13
N$4
  Bottom 0.254: IC6.5 27.94,84.92 27.94,80.48 28.57,80.48 29.21,79.84 29.21,76.67 38.73,76.67 40,77.94 SKT.15
N$5
  Bottom 0.254: SKT.16 38.09,79.84 38.09,84.29 38.73,84.29 39.36,84.92 39.36,88.1 32.38,88.1 31.11,86.83 IC6.6
N$6
  Top 0.254: SKT.17 35.55,79.84 33.02,82.38 33.02,84.92 IC6.7
N$7
  Top 0.254: SKT.18 33.02,79.84 31.75,81.11 31.75,87.46 32.38,88.1 35.55,88.1 35.55,87.46 IC6.8
N$8
  Bottom 0.254: SKT.19 31.11,79.21 37.46,85.56 IC6.9
N$9  (via drill 0.61)
  Top 0.254: v25.39,29.05 24.12,30.32 24.12,76.03 22.86,77.3 SKT.22
  Bottom 0.254: v25.39,29.05 29.21,29.05 32.38,25.87 IC9.2
N$10
  Top 0.254: IC9.1 32.38,28.41 30.48,30.32 30.48,45.55 29.21,46.83 29.21,76.03 27.94,77.3 SKT.20
N$11  (via drill 0.61)
  Top 0.254: v99.06,30.32 100.33,29.05 100.33,25.23 104.14,21.43 104.14,4.92 21.59,4.92 12.06,14.44 12.06,20.79 13.96,22.7 13.96,76.03 12.69,77.3 SKT.26
  Bottom 0.254: v99.06,30.32 96.52,32.86 IC8.13
N$12  (via drill 0.61)
  Top 0.254: v67.94,12.54 69.21,13.81 69.21,18.25 70.48,19.52 70.48,25.87 71.75,27.14 71.75,30.95 76.2,35.4 IC8.14 | 10.15,62.06 SKT.2 10.15,62.06 | 10.15,62.06 10.79,62.06 v10.79,15.71
  Bottom 0.254: v67.94,12.54 66.67,11.27 19.05,11.27 15.23,11.27 v10.79,15.71
N$13  (via drill 0.61)
  Top 0.254: v31.75,31.59 34.92,28.41 34.92,19.52 34.28,18.89 31.11,18.89 31.11,14.44 31.75,13.81 34.28,13.81 37.46,10.63 74.93,10.63 74.93,18.25 76.2,19.52 76.2,26.51 75.56,27.14 75.56,33.49 76.2,34.12 79.37,34.12 79.37,36.03 78.1,37.3 IC8.15
  Bottom 0.254: v31.75,31.59 22.22,41.11 11.42,41.11 11.42,68.41 20.32,77.3 SKT.23
N$14  (via drill 0.61)
  Top 0.254: v97.79,37.3 97.79,6.18 31.75,6.18 26.03,11.9 26.03,28.41 26.67,29.05 26.67,64.6 26.03,65.24 26.03,76.67 25.39,77.3 SKT.21
  Bottom 0.254: v97.79,37.3 94.61,40.48 78.73,40.48 IC8.16
N$15  (via drill 0.61)
  Top 0.254: v80.01,41.74 78.73,43.02 IC8.17 | SKT.24 17.78,77.3 16.51,76.03 16.51,57.62 15.87,56.98 15.87,23.33 17.14,22.06 17.14,11.27 22.22,6.18 v24.12,6.18
  Bottom 0.254: v24.12,6.18 99.69,6.18 107.95,14.44 107.95,41.74 v80.01,41.74
N$16  (via drill 0.61)
  Top 0.254: v69.21,96.35 v69.21,53.18 | v78.1,56.98 79.37,55.72 79.37,47.46 78.1,46.19 IC8.18
  Bottom 0.254: v69.21,96.35 67.31,98.26 21.59,98.26 21.59,92.54 16.51,87.46 15.23,87.46 15.23,79.84 SKT.25 | v69.21,53.18 66.67,53.18 65.4,54.45 67.94,56.98 v78.1,56.98
N$17
  Bottom 0.254: SKT.3 13.33,63.97 25.39,76.03 40.63,76.03 46.35,81.75 46.35,87.46 49.52,87.46 50.79,86.19 54.6,86.19 IC7.18
N$18  (via drill 0.61)
  Top 0.254: v46.35,74.77 50.79,74.77 v50.79,83.65
  Bottom 0.254: v46.35,74.77 26.67,74.77 15.87,63.97 SKT.4 | v50.79,83.65 54.6,83.65 IC7.17
N$19  (via drill 0.61)
  Top 0.254: v46.35,72.22 52.06,72.22 v52.06,81.11
  Bottom 0.254: v46.35,72.22 26.67,72.22 18.41,63.97 SKT.5 | v52.06,81.11 54.6,81.11 IC7.16
N$20  (via drill 0.61)
  Top 0.254: v53.34,51.27 53.34,65.88 53.97,66.51 53.97,76.67 55.24,77.94 IC7.15
  Bottom 0.254: v53.34,51.27 24.12,51.27 24.12,56.98 23.49,57.62 19.68,57.62 19.68,61.43 20.32,62.06 SKT.6
N$21  (via drill 0.61)
  Top 0.254: v22.86,72.22 22.86,64.6 SKT.7
  Bottom 0.254: v22.86,72.22 26.03,75.4 45.08,75.4 46.98,77.3 49.52,77.3 50.79,76.03 54.6,76.03 IC7.14
N$22  (via drill 0.61)
  Top 0.254: v57.78,58.89 57.78,71.59 56.51,72.86 IC7.13
  Bottom 0.254: v57.78,58.89 57.14,58.26 20.32,58.26 20.32,60.8 21.59,62.06 22.22,61.43 23.49,61.43 24.76,62.7 SKT.8
N$23  (via drill 0.61)
  Top 0.254: v50.16,67.14 50.79,67.78 v50.79,70.95
  Bottom 0.254: v50.16,67.14 26.67,67.14 26.67,65.88 27.94,64.6 SKT.9 | v50.79,70.95 54.6,70.95 IC7.12
N$24
  Bottom 0.254: SKT.10 31.11,63.97 33.02,65.88 52.06,65.88 54.6,68.41 IC7.11
N$25
  Top 0.254: IC9.4 32.38,20.79 32.38,22.06 IC9.3
RESET
  Top 0.254: IC10.5 20.32,18.25 20.32,19.52 IC10.4
  Bottom 0.254: JP1.1 16.51,20.16 19.05,20.16 IC10.4
SELA  (via drill 0.61)
  Top 0.254: v21.59,39.84 21.59,53.18 22.86,54.45 IC4.19 | v29.21,32.22 29.84,31.59 29.84,13.17 33.65,9.36 85.72,9.36 85.72,18.25 86.99,19.52 86.99,25.87 87.62,26.51 87.62,32.86 88.9,34.12 IC13.14
  Bottom 0.254: v29.21,32.22 v21.59,39.84
SELB  (via drill 0.61)
  Top 0.254: v37.46,25.87 37.46,30.32 31.75,36.03 31.75,53.18 30.48,54.45 IC4.16 | v85.72,23.96 86.36,24.6 86.36,26.51 IC13.2
  Bottom 0.254: v37.46,25.87 39.36,23.96 54.6,23.96 59.68,18.89 83.81,18.89 84.45,19.52 84.45,23.96 v85.72,23.96
VCC  (via drill 0.61)
  Top 0.508: IC6.20 17.14,93.81 15.87,93.81 C6.1 | IC10.14 27.94,28.41 27.94,29.68 C10.1 27.94,30.95 v27.94,42.38 | IC9.14 40.63,28.41 40.63,29.68 C9.1 | 19.05,55.72 19.68,55.72 IC4.20 | 19.05,55.72 18.41,55.72 C4.1 | 19.05,55.72 19.05,91.27 17.78,92.54 IC6.20 | IC7.20 55.88,91.91 55.88,93.18 C7.1 55.88,94.45 55.88,97.62 21.59,97.62 18.41,94.45 IC6.20 | IC3.30 76.83,91.91 78.1,93.18 78.1,94.45 76.83,95.72 IC3.32 76.2,96.99 76.2,98.26 C3.1 | IC13.16 83.18,35.4 81.91,35.4 C13.1 81.28,36.03 v81.28,50 v81.28,67.14 | IC8.20 77.47,51.27 77.47,52.54 C8.1 | IC12.20 91.44,66.51 91.44,67.78 C12.1 | IC2.14 104.14,63.97 104.14,65.24 C2.1 | IC11.20 91.44,96.99 91.44,98.26 C11.1 92.07,98.89 104.14,98.89 104.14,96.99 C1.1 104.14,95.72 104.14,94.45 IC1.14
  Bottom 0.508: SKT.28 7.62,79.84 7.62,93.81 14.6,93.81 C6.1 | C10.1 28.57,30.32 29.21,29.68 34.28,29.68 36.19,27.78 39.36,27.78 IC9.14 | IC5.20 40,43.02 38.73,43.02 C5.1 38.09,43.65 31.75,43.65 | 31.75,43.65 31.75,49.37 31.11,50 20.32,50 20.32,54.45 IC4.20 | v27.94,42.38 29.21,43.65 31.75,43.65 | IC7.20 57.14,91.27 58.41,92.54 73.66,92.54 74.93,91.27 IC3.30 | v81.28,50 80.64,50.63 78.73,50.63 IC8.20 | IC2.14 102.87,63.34 101.59,62.06 95.25,62.06 92.07,65.24 IC12.20 90.17,65.88 88.26,65.88 86.99,67.14 v81.28,67.14 | C2.1 104.14,66.51 104.14,77.3 106.04,77.3 108.58,79.84 108.58,93.18 104.77,93.18 IC1.14 | C3.1 76.83,98.89 77.47,98.26 85.09,98.26 86.99,96.35 90.17,96.35 IC11.20